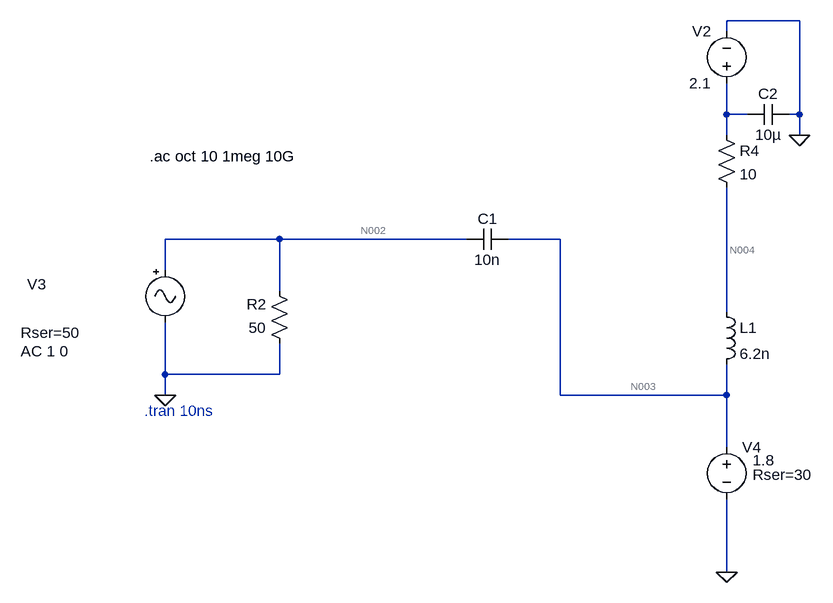
[diagram p0: schematic test_spice.asc]
test_spice.asc, the LTspice schematic file:
Version 4.1
SHEET 1 1396 680
WIRE 672 -272 560 -272
WIRE 560 -256 560 -272
WIRE 560 -128 560 -176
WIRE 592 -128 560 -128
WIRE 672 -128 672 -272
WIRE 672 -128 656 -128
WIRE 560 -96 560 -128
WIRE 672 -96 672 -128
WIRE -128 64 -304 64
WIRE 160 64 -128 64
WIRE 304 64 224 64
WIRE -304 112 -304 64
WIRE -128 144 -128 64
WIRE 560 176 560 -16
WIRE -304 272 -304 192
WIRE -128 272 -128 224
WIRE -128 272 -304 272
WIRE -304 304 -304 272
WIRE 304 304 304 64
WIRE 560 304 560 256
WIRE 560 304 304 304
WIRE 560 384 560 304
WIRE 560 576 560 464
FLAG -304 304 0
FLAG 672 -96 0
FLAG 560 576 0
DATAFLAG 336 304 ""
SYMBOL voltage 560 -160 R180
WINDOW 0 24 96 Left 2
WINDOW 3 24 16 Left 2
WINDOW 123 0 0 Left 0
WINDOW 39 24 68 Left 2
SYMATTR InstName V2
SYMATTR Value 2.1
SYMBOL Misc\\signal -304 96 R0
WINDOW 0 -212 37 Left 2
WINDOW 3 -222 140 Left 2
WINDOW 123 -222 140 Left 2
WINDOW 39 -222 112 Left 2
SYMATTR InstName V3
SYMATTR Value ""
SYMATTR Value2 AC 1 0
SYMATTR SpiceLine Rser=50
SYMBOL res -112 240 R180
WINDOW 0 36 76 Left 2
WINDOW 3 36 40 Left 2
SYMATTR InstName R2
SYMATTR Value 50
SYMBOL ind 544 160 R0
SYMATTR InstName L1
SYMATTR Value 6.2n
SYMATTR SpiceLine Ipk=1.8 Rser=48m Rpar=13.28 Cpar=0.0393p
SYMBOL voltage 560 368 R0
WINDOW 3 40 36 Left 2
WINDOW 123 0 0 Left 0
WINDOW 39 40 58 Left 2
SYMATTR Value 1.8
SYMATTR SpiceLine Rser=30
SYMATTR InstName V4
SYMBOL res 544 -112 R0
SYMATTR InstName R4
SYMATTR Value 10
SYMBOL cap 656 -144 R90
WINDOW 0 0 32 VBottom 2
WINDOW 3 32 32 VTop 2
SYMATTR InstName C2
SYMATTR Value 10µ
SYMBOL cap 224 48 R90
WINDOW 0 0 32 VBottom 2
WINDOW 3 32 32 VTop 2
SYMATTR InstName C1
SYMATTR Value 10n
TEXT -336 328 Left 2 ;.tran 10ns
TEXT -328 -64 Left 2 !.ac oct 10 1meg 10G

The netlist it stands for:
* test_spice.asc
V2 N001 0 2.1
V3 N002 0 AC 1 0 Rser=50
R2 0 N002 50
L1 N004 N003 6.2n Ipk=1.8 Rser=48m Rpar=13.28 Cpar=0.0393p
V4 N003 0 1.8 Rser=30
R4 N001 N004 10
C2 0 N001 10µ
C1 N003 N002 10n
* .tran 10ns
.ac oct 10 1meg 10G
.backanno
.end

* Results of the author's LTspice run, read from the files saved beside the schematic
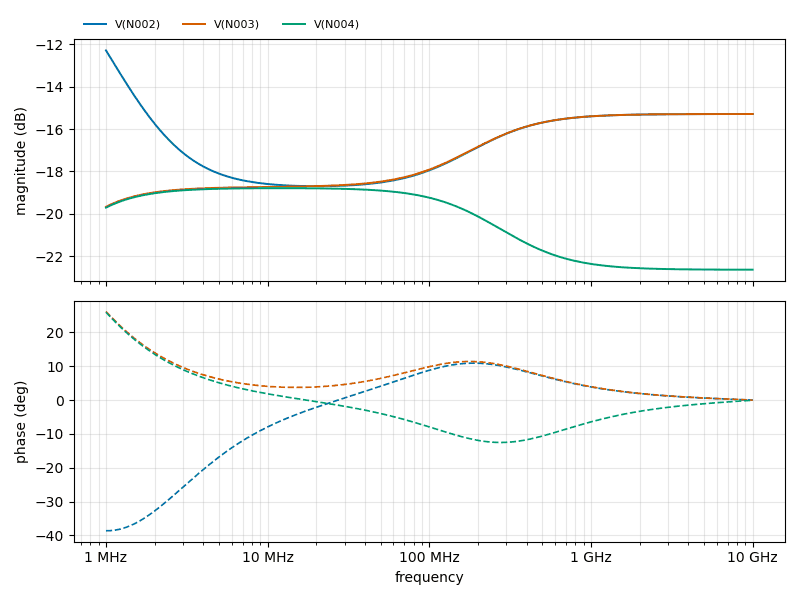
[diagram p1: AC Analysis of test_spice.asc, plotted from the saved traces]
* AC Analysis, 1 run:
*   V(N002): -12.29 dB at 1 MHz, -15.29 dB at 10 GHz, peak -12.29 dB at 1 MHz, 3 dB below the peak at 1.803 MHz
*   V(N003): -19.66 dB at 1 MHz, -15.29 dB at 10 GHz, peak -15.29 dB at 10 GHz, 3 dB below the peak at 67.33 MHz
*   V(N004): -19.70 dB at 1 MHz, -22.63 dB at 10 GHz, peak -18.79 dB at 12.13 MHz, 3 dB below the peak at 526 MHz